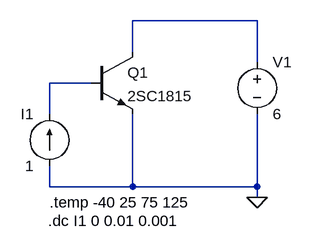
[diagram p0: schematic TEMP.asc]
TEMP.asc, the LTspice schematic file:
Version 4
SHEET 1 880 680
WIRE 352 64 160 64
WIRE 160 112 160 64
WIRE 352 128 352 64
WIRE 96 160 32 160
WIRE 32 208 32 160
WIRE 32 320 32 288
WIRE 160 320 160 208
WIRE 160 320 32 320
WIRE 352 320 352 208
WIRE 352 320 160 320
WIRE 352 336 352 320
FLAG 352 336 0
SYMBOL npn 96 112 R0
SYMATTR InstName Q1
SYMATTR Value 2SC1815
SYMBOL voltage 352 112 R0
WINDOW 123 0 0 Left 0
WINDOW 39 0 0 Left 0
SYMATTR InstName V1
SYMATTR Value 6
SYMBOL current 32 288 R180
WINDOW 0 24 80 Left 2
WINDOW 3 24 0 Left 2
WINDOW 123 0 0 Left 0
WINDOW 39 0 0 Left 0
SYMATTR InstName I1
SYMATTR Value 1
TEXT 32 344 Left 2 !.temp -40 25 75 125
TEXT 30 372 Left 2 !.dc I1 0 0.01 0.001

The netlist it stands for:
* TEMP.asc
Q1 N001 N002 0 0 2SC1815
V1 N001 0 6
I1 0 N002 1
.model NPN NPN
.model PNP PNP
.lib standard.bjt
.temp -40 25 75 125
.dc I1 0 0.01 0.001
.backanno
.end